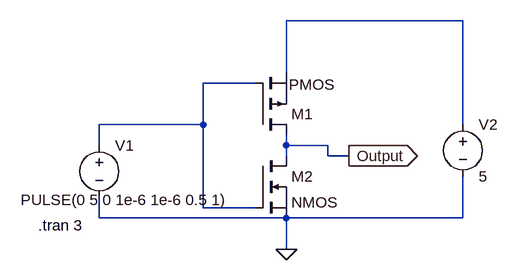
[diagram p0: schematic CMOS inverter.asc]
CMOS inverter.asc, the LTspice schematic file:
Version 4.1
SHEET 1 880 680
WIRE 480 -32 208 -32
WIRE 208 48 208 -32
WIRE 160 64 80 64
WIRE 80 128 80 64
WIRE 80 128 -80 128
WIRE 480 128 480 -32
WIRE -80 160 -80 128
WIRE 208 160 208 144
WIRE 272 160 208 160
WIRE 208 176 208 160
WIRE 272 176 272 160
WIRE 304 176 272 176
WIRE 80 256 80 128
WIRE 160 256 80 256
WIRE -80 272 -80 240
WIRE 208 272 -80 272
WIRE 480 272 480 208
WIRE 480 272 208 272
WIRE 208 320 208 272
FLAG 208 320 0
FLAG 304 176 Output
IOPIN 304 176 Out
SYMBOL pmos 160 144 M180
WINDOW 3 52 78 Left 2
SYMATTR InstName M1
SYMBOL nmos 160 176 R0
SYMATTR InstName M2
SYMBOL voltage -80 144 R0
WINDOW 123 0 0 Left 0
WINDOW 39 0 0 Left 0
WINDOW 3 -121 100 Left 2
SYMATTR Value PULSE(0 5 0 1e-6 1e-6 0.5 1)
SYMATTR InstName V1
SYMBOL voltage 480 112 R0
WINDOW 123 0 0 Left 0
WINDOW 39 0 0 Left 0
SYMATTR InstName V2
SYMATTR Value 5
TEXT -174 283 Left 2 !.tran 3

The netlist it stands for:
* CMOS inverter.asc
M1 Output N002 N001 N001 PMOS
M2 Output N002 0 0 NMOS
V1 N002 0 PULSE(0 5 0 1e-6 1e-6 0.5 1)
V2 N001 0 5
.model NMOS NMOS
.model PMOS PMOS
.lib standard.mos
.tran 3
.backanno
.end